# Altium schematic sheet Block Diagram.SchDoc
size A3; Organization: My Company; Address1: Address Line 1; Address2: Address Line 2; Address3: Address Line 3; Address4: Address Line 4; SheetNumber: 5; SheetTotal: 5
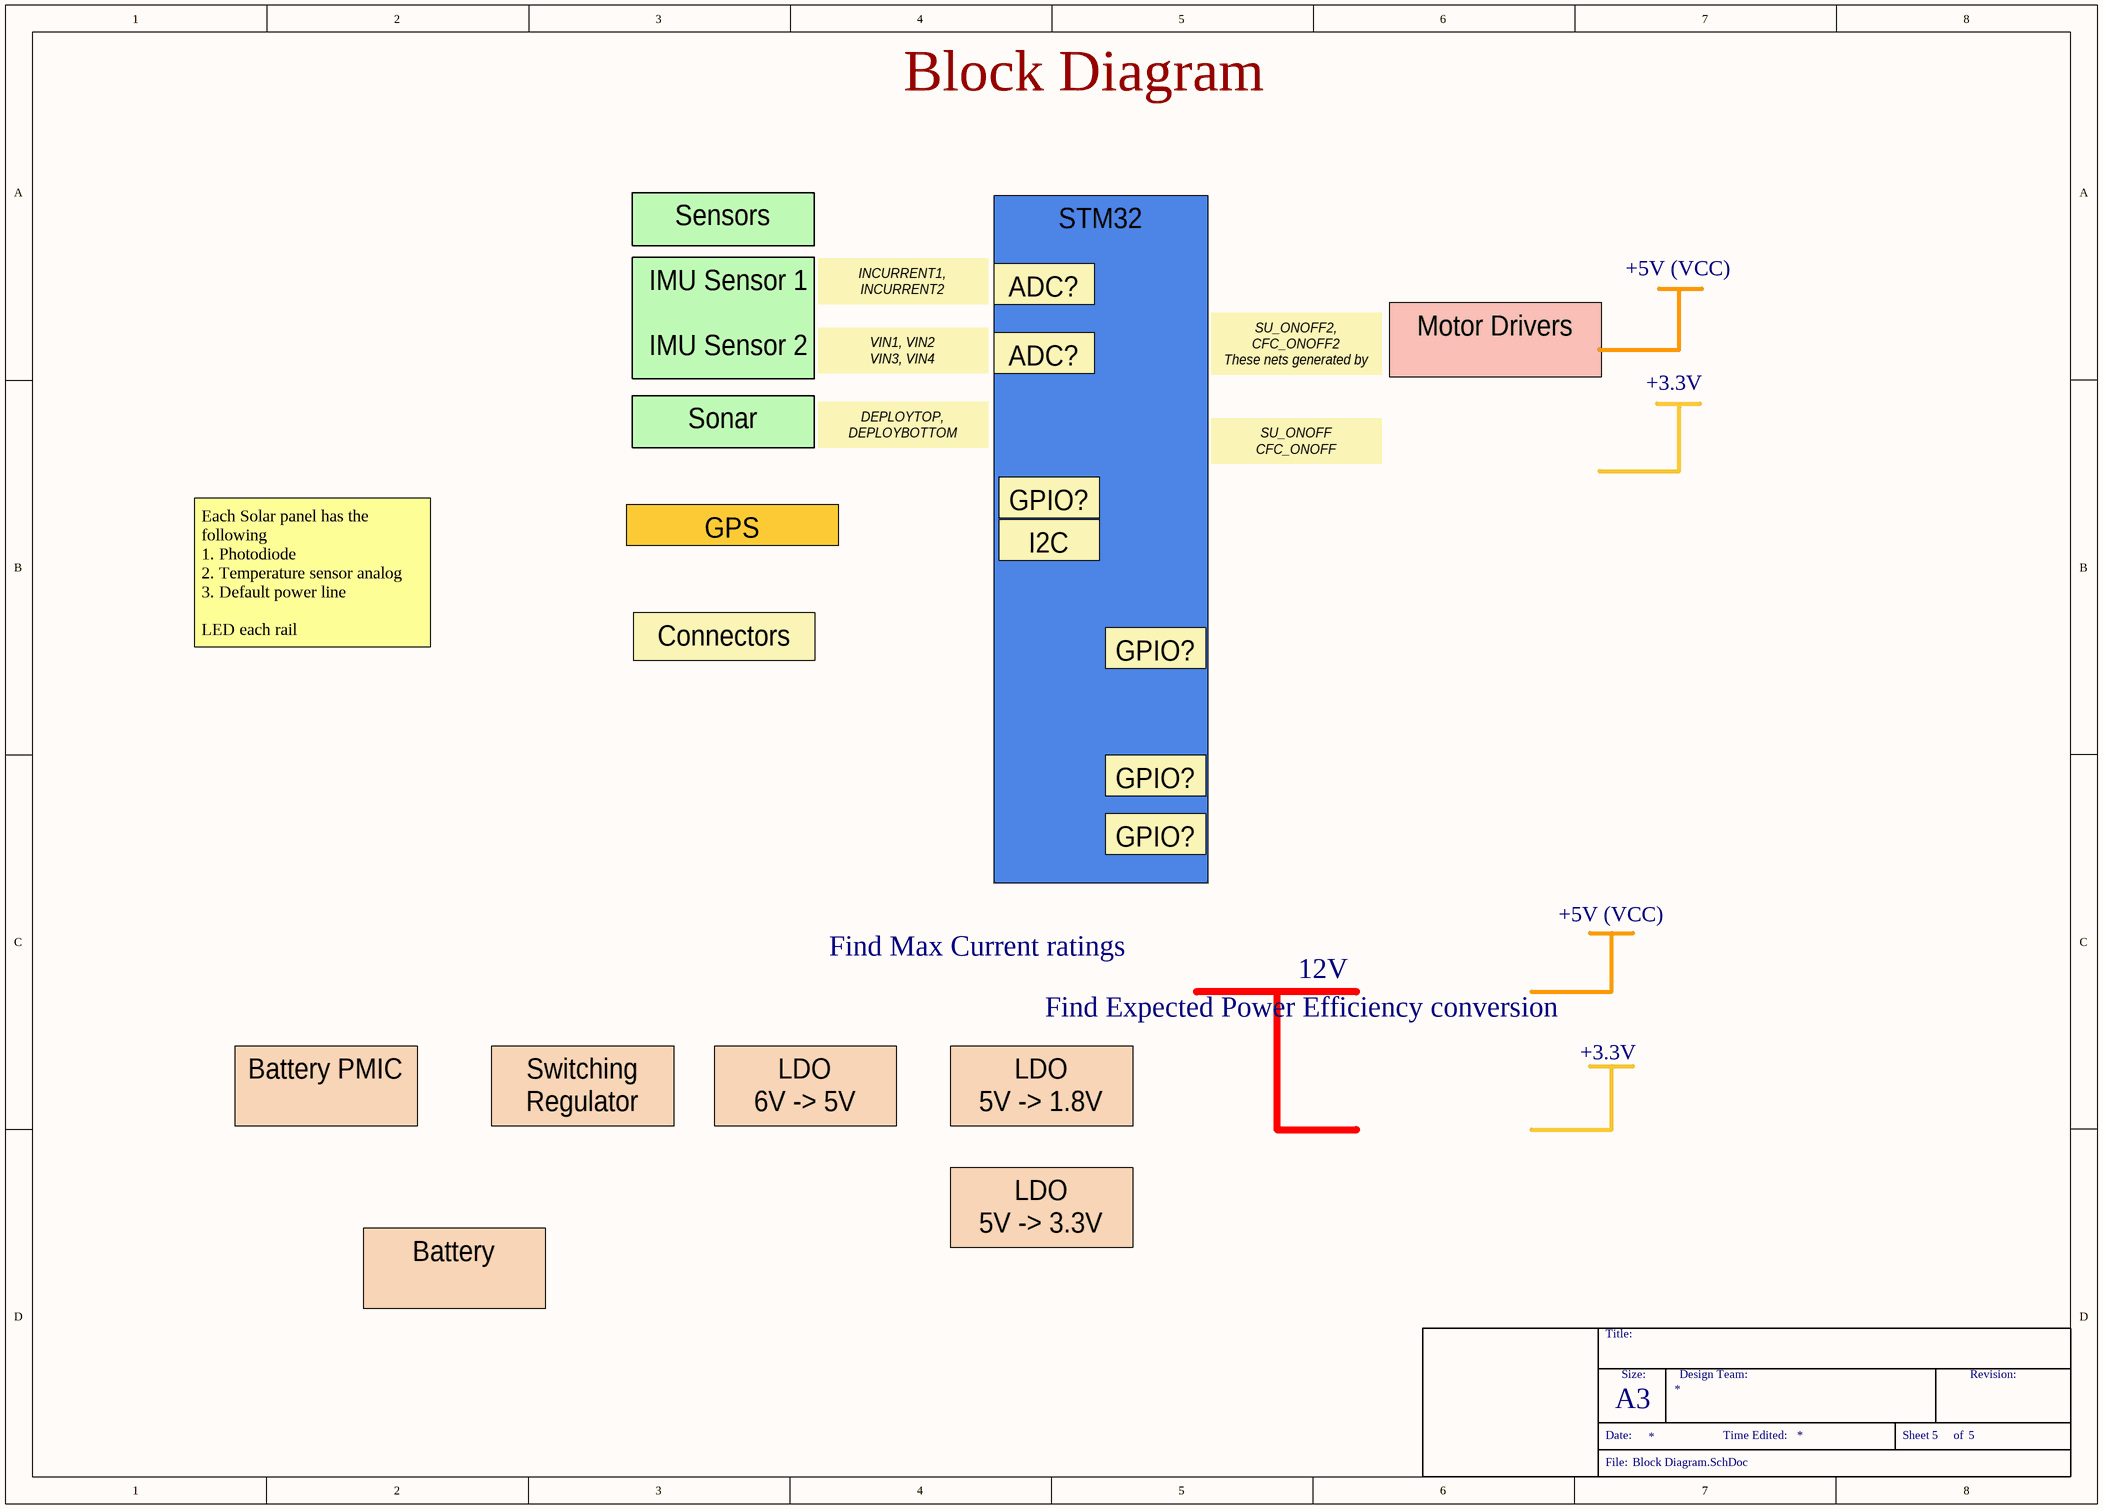
[diagram p0: Block Diagram.SchDoc]

## Notes on the sheet
- Block Diagram
- Sensors
- INCURRENT1, INCURRENT2
  INCURRENT3, INCURRENT4
- ADC?
- +5V (VCC)
- IMU Sensor 1
  IMU Sensor 2
- VIN1, VIN2
  VIN3, VIN4
- SU_ONOFF2, CFC_ONOFF2
  These nets generated by 3.3V MOSFETS, not STM32
- Motor Drivers
- Sonar
- DEPLOYTOP, DEPLOYBOTTOM
  DEPLOYRIGHT, DEPLOYLEFT
- +3.3V
- GPIO?
- SU_ONOFF
  CFC_ONOFF
- GPS
- I2C
- Each Solar panel has the following
  1. Photodiode
  2. Temperature sensor analog
  3. Default power line
  LED each rail
- Connectors
- STM32
- Find Max Current ratings
- 12V
- Find Expected Power Efficiency conversion
- Battery PMIC
- Switching Regulator
- LDO
  6V -> 5V
- LDO
  5V -> 1.8V
- LDO
  5V -> 3.3V
- Battery
- Title:
- Size:
- Design Team:
- Revision:
- Date:
- A3
- Time Edited:
- Sheet
- of
- File: